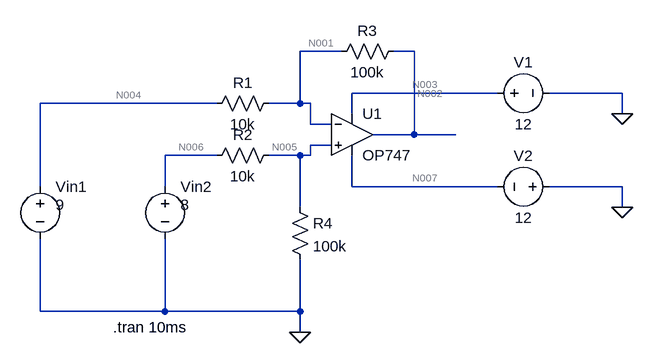
[diagram p0: schematic Difference_Amplifier.asc]
Difference_Amplifier.asc, the LTspice schematic file:
Version 4
SHEET 1 880 680
WIRE 208 48 144 48
WIRE 320 48 288 48
WIRE 448 112 224 112
WIRE 640 112 528 112
WIRE 16 128 -256 128
WIRE 144 128 144 48
WIRE 144 128 96 128
WIRE 160 128 144 128
WIRE 224 144 224 112
WIRE 640 144 640 112
WIRE 160 160 160 128
WIRE 192 160 160 160
WIRE 320 176 320 48
WIRE 320 176 256 176
WIRE 384 176 320 176
WIRE 192 192 160 192
WIRE 16 208 -64 208
WIRE 144 208 96 208
WIRE 160 208 160 192
WIRE 160 208 144 208
WIRE -256 256 -256 128
WIRE -64 256 -64 208
WIRE 224 256 224 208
WIRE 448 256 224 256
WIRE 640 256 528 256
WIRE 144 288 144 208
WIRE 640 288 640 256
WIRE -256 448 -256 336
WIRE -64 448 -64 336
WIRE -64 448 -256 448
WIRE 144 448 144 368
WIRE 144 448 -64 448
WIRE 144 480 144 448
FLAG 640 144 0
FLAG 640 288 0
FLAG 144 480 0
SYMBOL voltage 432 112 R270
WINDOW 0 32 56 VTop 2
WINDOW 3 -32 56 VBottom 2
WINDOW 123 0 0 Left 0
WINDOW 39 0 0 Left 0
SYMATTR InstName V1
SYMATTR Value 12
SYMBOL voltage 544 256 R90
WINDOW 0 -32 56 VBottom 2
WINDOW 3 32 56 VTop 2
WINDOW 123 0 0 Left 0
WINDOW 39 0 0 Left 0
SYMATTR InstName V2
SYMATTR Value 12
SYMBOL res 112 112 R90
WINDOW 0 0 56 VBottom 2
WINDOW 3 32 56 VTop 2
SYMATTR InstName R1
SYMATTR Value 10k
SYMBOL res 112 192 R90
WINDOW 0 0 56 VBottom 2
WINDOW 3 32 56 VTop 2
SYMATTR InstName R2
SYMATTR Value 10k
SYMBOL res 304 32 R90
WINDOW 0 0 56 VBottom 2
WINDOW 3 32 56 VTop 2
SYMATTR InstName R3
SYMATTR Value 100k
SYMBOL res 128 272 R0
SYMATTR InstName R4
SYMATTR Value 100k
SYMBOL OpAmps\\OP747 224 112 R0
SYMATTR InstName U1
SYMBOL voltage -256 240 R0
WINDOW 123 0 0 Left 0
WINDOW 39 0 0 Left 0
WINDOW 3 24 44 Left 2
SYMATTR Value 9
SYMATTR InstName Vin1
SYMBOL voltage -64 240 R0
WINDOW 123 0 0 Left 0
WINDOW 39 0 0 Left 0
WINDOW 3 24 44 Left 2
SYMATTR Value 8
SYMATTR InstName Vin2
TEXT -144 472 Left 2 !.tran 10ms

The netlist it stands for:
* Difference_Amplifier.asc
V1 N003 0 12
V2 0 N007 12
R1 N001 N004 10k
R2 N005 N006 10k
R3 N002 N001 100k
R4 N005 0 100k
XU1 N005 N001 N003 N007 N002 OP747  ; pins In+ In- V+ V- OUT
Vin1 N004 0 9
Vin2 N006 0 8
.tran 10ms
.backanno
.end

* Results of the author's LTspice run, read from the files saved beside the schematic
* Operating Point, zero values left out:
*   V(n003) = 12 V
*   V(n007) = -12 V
*   V(n001) = 7.273 V
*   V(n004) = 9 V
*   V(n005) = 7.273 V
*   V(n006) = 8 V
*   V(n002) = -9.999 V
*   I(R1) = -172.7 µA
*   I(R2) = -72.72 µA
*   I(R3) = -172.7 µA
*   I(R4) = 72.73 µA
*   I(V1) = -213.4 µA
*   I(V2) = -386.1 µA
*   I(Vin1) = -172.7 µA
*   I(Vin2) = -72.72 µA
*   Ix(u1:1) = -10.57 nA
*   Ix(u1:2) = -8.569 nA
*   Ix(u1:99) = 213.4 µA
*   Ix(u1:50) = -386.1 µA
*   Ix(u1:45) = 172.7 µA